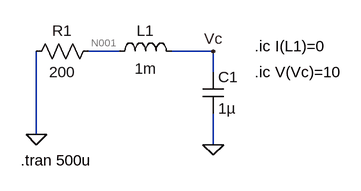
[diagram p0: schematic overdamped_RLC.asc]
overdamped_RLC.asc, the LTspice schematic file:
Version 4
SHEET 1 880 680
WIRE 128 112 80 112
WIRE 272 112 208 112
WIRE 272 144 272 112
WIRE 0 240 0 112
WIRE 272 256 272 208
FLAG 272 256 0
FLAG 0 240 0
FLAG 272 112 Vc
SYMBOL res 96 96 R90
WINDOW 0 0 56 VBottom 2
WINDOW 3 32 56 VTop 2
SYMATTR InstName R1
SYMATTR Value 200
SYMBOL ind 112 128 R270
WINDOW 0 32 56 VTop 2
WINDOW 3 5 56 VBottom 2
SYMATTR InstName L1
SYMATTR Value 1m
SYMBOL cap 256 144 R0
SYMATTR InstName C1
SYMATTR Value 1µ
TEXT 336 104 Left 2 !.ic I(L1)=0
TEXT 336 144 Left 2 !.ic V(Vc)=10
TEXT -24 280 Left 2 !.tran 500u

The netlist it stands for:
* overdamped_RLC.asc
R1 N001 0 200
L1 N001 Vc 1m
C1 Vc 0 1µ
.ic I(L1)=0
.ic V(Vc)=10
.tran 500u
.backanno
.end

* Results of the author's LTspice run, read from the files saved beside the schematic
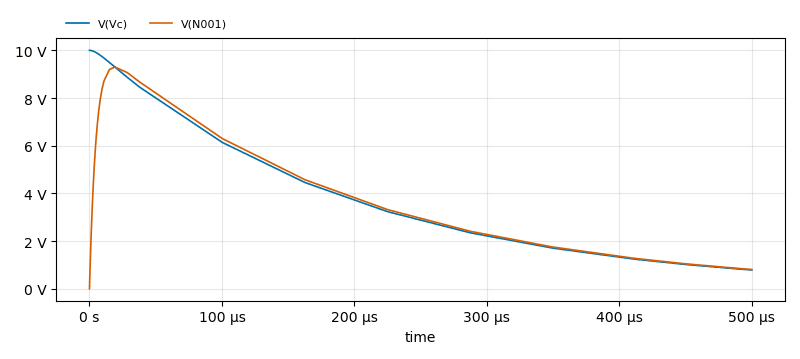
[diagram p1: Transient Analysis of overdamped_RLC.asc, plotted from the saved traces]
* Transient Analysis, 1 run:
*   V(Vc): min 789.3 mV, max 10 V, average 3.717 V, rms 4.566 V, last 789.3 mV
*   V(N001): min 2 µV, max 9.302 V, average 3.708 V, rms 4.51 V, last 810.1 mV